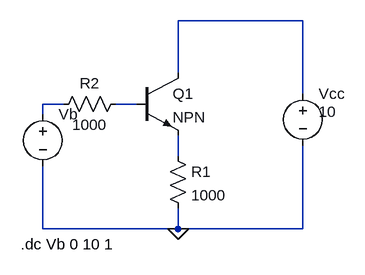
[diagram p0: schematic Bjt_bias_1.asc]
Bjt_bias_1.asc, the LTspice schematic file:
Version 4
SHEET 1 880 680
WIRE 448 -16 256 -16
WIRE 256 64 256 -16
WIRE 448 96 448 -16
WIRE 80 112 48 112
WIRE 192 112 160 112
WIRE 48 128 48 112
WIRE 256 192 256 160
WIRE 48 304 48 208
WIRE 256 304 256 272
WIRE 256 304 48 304
WIRE 448 304 448 176
WIRE 448 304 256 304
FLAG 256 304 0
SYMBOL npn 192 64 R0
SYMATTR InstName Q1
SYMBOL voltage 48 112 R0
WINDOW 123 0 0 Left 2
WINDOW 39 0 0 Left 2
SYMATTR InstName Vb
SYMATTR Value ""
SYMBOL voltage 448 80 R0
WINDOW 3 24 44 Left 2
WINDOW 123 0 0 Left 2
WINDOW 39 0 0 Left 2
SYMATTR InstName Vcc
SYMATTR Value 10
SYMBOL res 240 176 R0
SYMATTR InstName R1
SYMATTR Value 1000
SYMBOL res 64 128 R270
WINDOW 0 32 56 VTop 2
WINDOW 3 0 56 VBottom 2
SYMATTR InstName R2
SYMATTR Value 1000
TEXT 14 328 Left 2 !.dc Vb 0 10 1

The netlist it stands for:
* Bjt_bias_1.asc
Q1 N001 N003 N004 0 NPN
Vb N002 0
Vcc N001 0 10
R1 N004 0 1000
R2 N002 N003 1000
.model NPN NPN
.model PNP PNP
.lib standard.bjt
.dc Vb 0 10 1
.backanno
.end

* Results of the author's LTspice run, read from the files saved beside the schematic
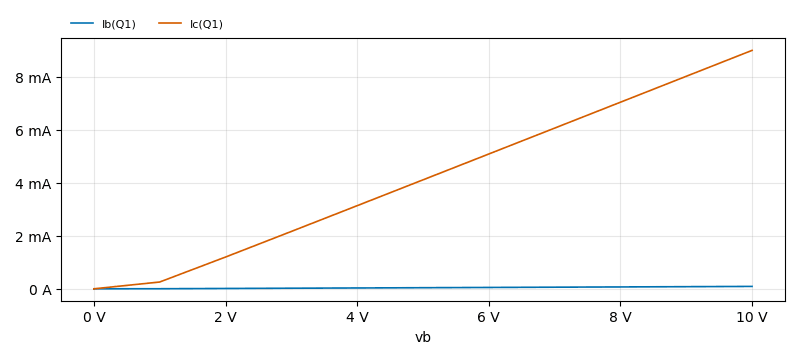
[diagram p1: DC transfer characteristic of Bjt_bias_1.asc, plotted from the saved traces]
* DC transfer characteristic, 1 run:
*   Ib(Q1): -10 pA at vb=0 V, 89.89 µA at vb=10 V, min -10 pA, max 89.89 µA
*   Ic(Q1): 10 pA at vb=0 V, 8.989 mA at vb=10 V, min 10 pA, max 8.989 mA